# EAGLE design immerlighter-1.0 (EAGLE 5.12)
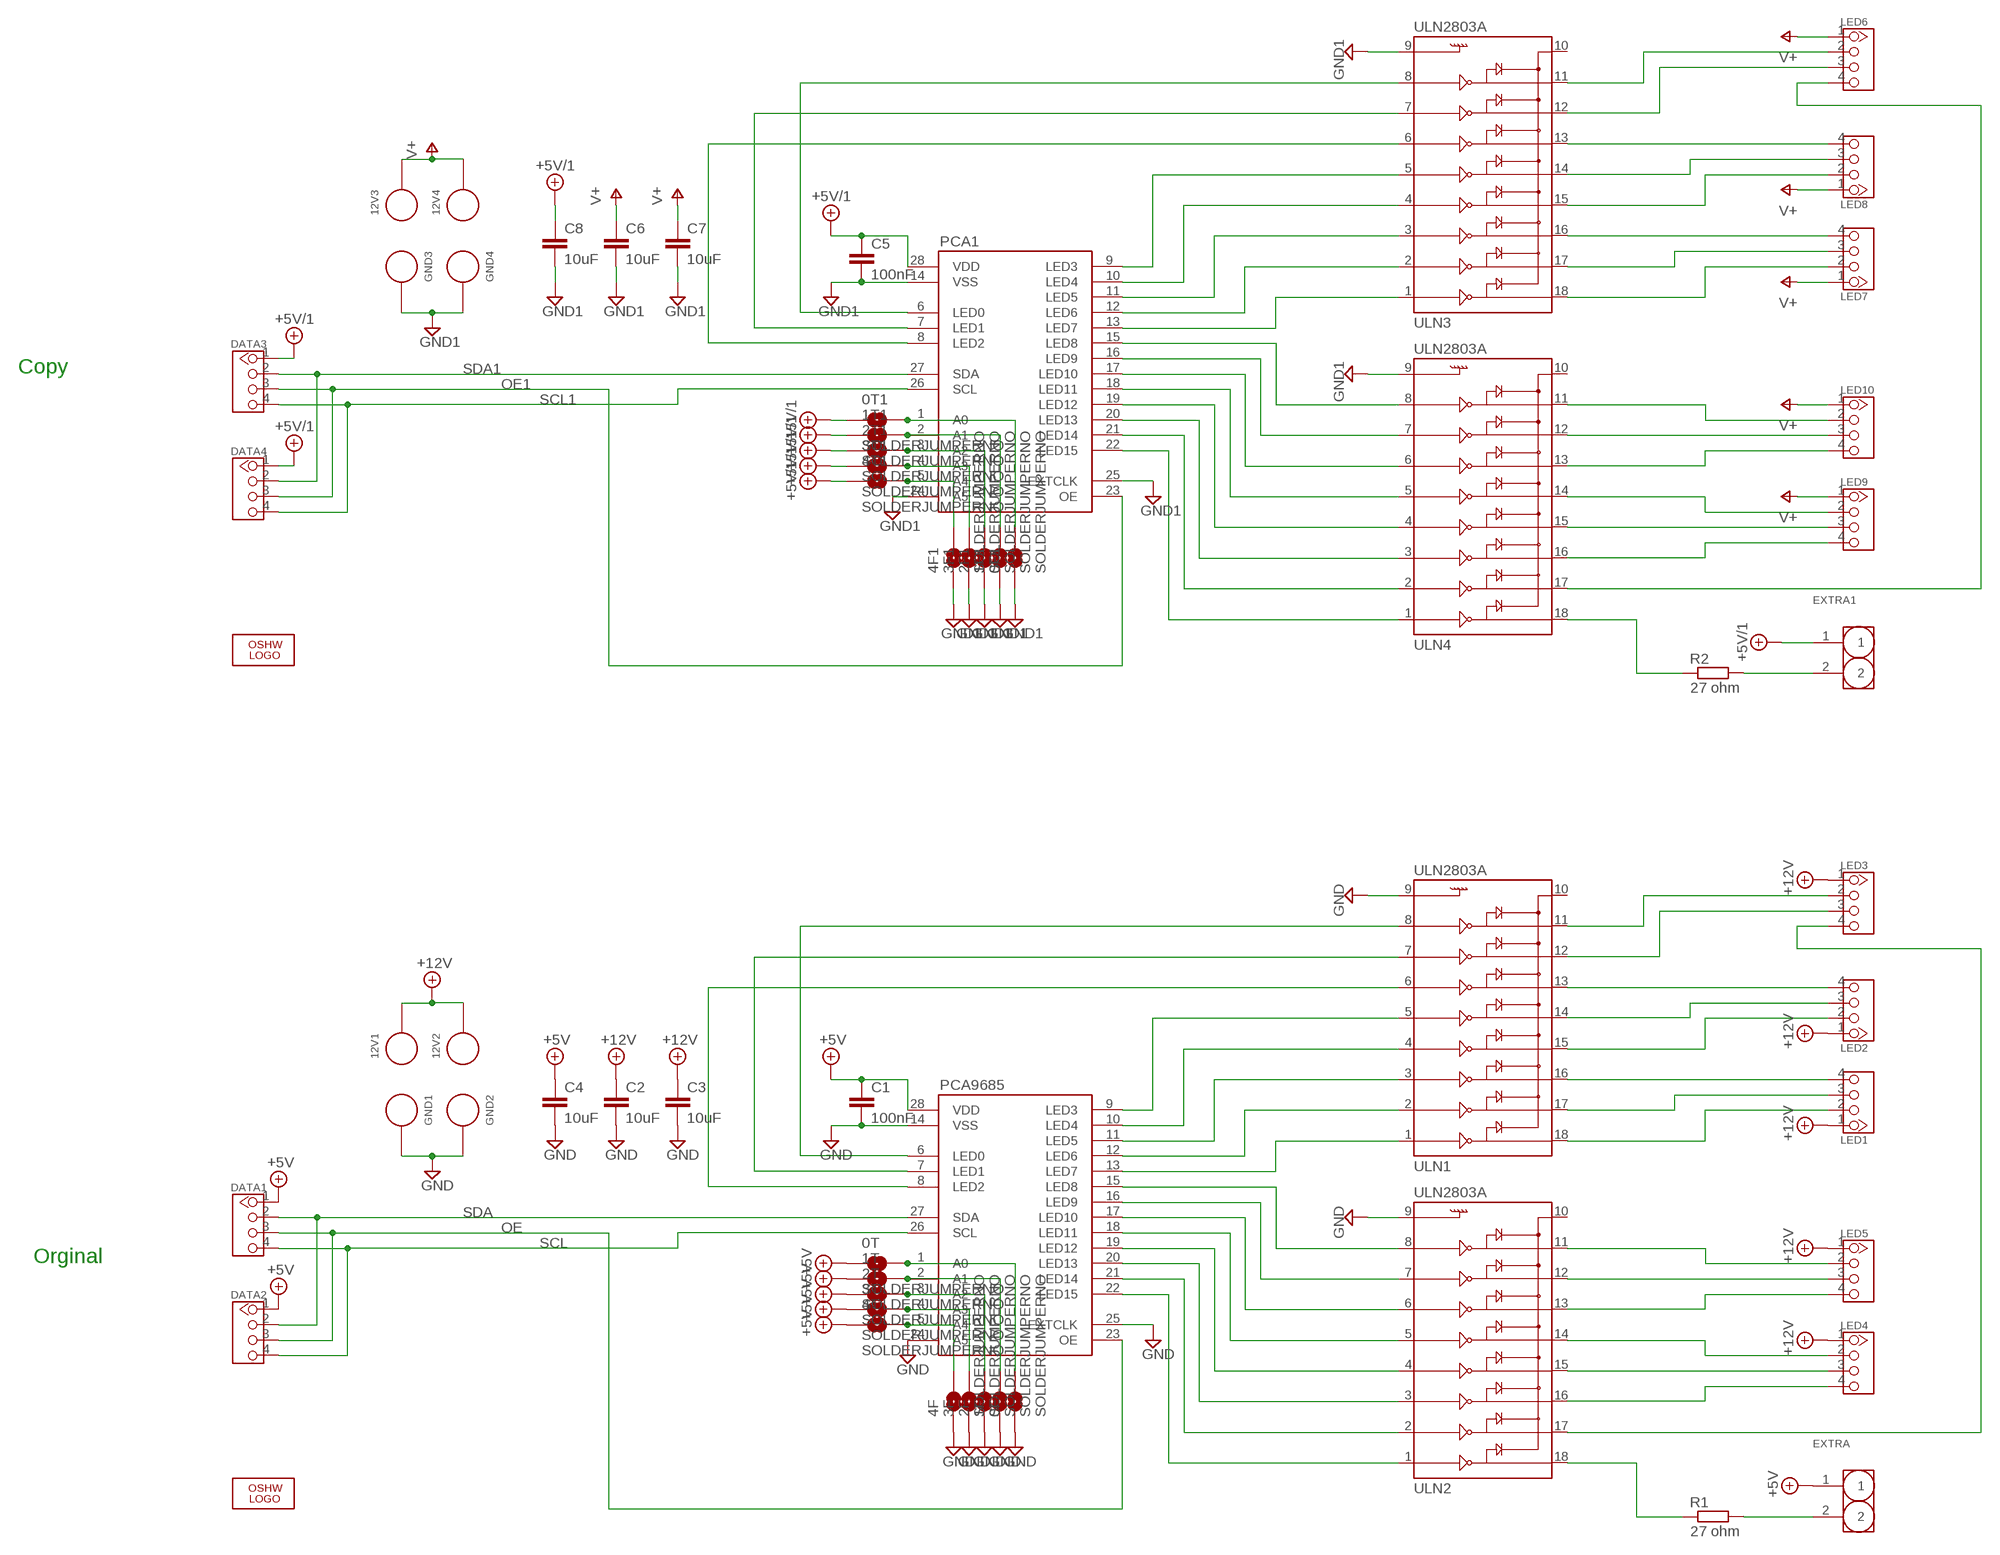
[diagram p0: schematic, sheet 1]

## Parts
0F  SOLDERJUMPERNO  [SJ_2S-NO]
0F1  SOLDERJUMPERNO  [SJ_2S-NO]
0T  SOLDERJUMPERNO  [SJ_2S-NO]
0T1  SOLDERJUMPERNO  [SJ_2S-NO]
1F  SOLDERJUMPERNO  [SJ_2S-NO]
1F1  SOLDERJUMPERNO  [SJ_2S-NO]
1T  SOLDERJUMPERNO  [SJ_2S-NO]
1T1  SOLDERJUMPERNO  [SJ_2S-NO]
2F  SOLDERJUMPERNO  [SJ_2S-NO]
2F1  SOLDERJUMPERNO  [SJ_2S-NO]
2T  SOLDERJUMPERNO  [SJ_2S-NO]
2T1  SOLDERJUMPERNO  [SJ_2S-NO]
3F  SOLDERJUMPERNO  [SJ_2S-NO]
3F1  SOLDERJUMPERNO  [SJ_2S-NO]
3T  SOLDERJUMPERNO  [SJ_2S-NO]
3T1  SOLDERJUMPERNO  [SJ_2S-NO]
4F  SOLDERJUMPERNO  [SJ_2S-NO]
4F1  SOLDERJUMPERNO  [SJ_2S-NO]
4T  SOLDERJUMPERNO  [SJ_2S-NO]
4T1  SOLDERJUMPERNO  [SJ_2S-NO]
12V1  LARGE_WIRE_PAD  [LARGE_WIRE_PAD_PACK]
12V2  LARGE_WIRE_PAD  [LARGE_WIRE_PAD_PACK]
12V3  LARGE_WIRE_PAD  [LARGE_WIRE_PAD_PACK]
12V4  LARGE_WIRE_PAD  [LARGE_WIRE_PAD_PACK]
C1  100nF  C-EUC3216  [C3216]
C2  10uF  C-EUC3216  [C3216]
C3  10uF  C-EUC3216  [C3216]
C4  10uF  C-EUC3216  [C3216]
C5  100nF  C-EUC3216  [C3216]
C6  10uF  C-EUC3216  [C3216]
C7  10uF  C-EUC3216  [C3216]
C8  10uF  C-EUC3216  [C3216]
DATA1  HEADER-4P-80/40MIL  [4P-2.54-80/40MIL]
DATA2  HEADER-4P-80/40MIL  [4P-2.54-80/40MIL]
DATA3  HEADER-4P-80/40MIL  [4P-2.54-80/40MIL]
DATA4  HEADER-4P-80/40MIL  [4P-2.54-80/40MIL]
EXTRA  HEADER-2P-2.54  [2P-2.54]
EXTRA1  HEADER-2P-2.54  [2P-2.54]
GND1  LARGE_WIRE_PAD  [LARGE_WIRE_PAD_PACK]
GND2  LARGE_WIRE_PAD  [LARGE_WIRE_PAD_PACK]
GND3  LARGE_WIRE_PAD  [LARGE_WIRE_PAD_PACK]
GND4  LARGE_WIRE_PAD  [LARGE_WIRE_PAD_PACK]
LED1  HEADER-4P-80/40MIL  [4P-2.54-80/40MIL]
LED2  HEADER-4P-80/40MIL  [4P-2.54-80/40MIL]
LED3  HEADER-4P-80/40MIL  [4P-2.54-80/40MIL]
LED4  HEADER-4P-80/40MIL  [4P-2.54-80/40MIL]
LED5  HEADER-4P-80/40MIL  [4P-2.54-80/40MIL]
LED6  HEADER-4P-80/40MIL  [4P-2.54-80/40MIL]
LED7  HEADER-4P-80/40MIL  [4P-2.54-80/40MIL]
LED8  HEADER-4P-80/40MIL  [4P-2.54-80/40MIL]
LED9  HEADER-4P-80/40MIL  [4P-2.54-80/40MIL]
LED10  HEADER-4P-80/40MIL  [4P-2.54-80/40MIL]
LOGO1  LOGO-OSHW-6MILX0070-NT  [OSHW_6X70_NOTEXT]
LOGO2  LOGO-OSHW-6MILX0070-NT  [OSHW_6X70_NOTEXT]
PCA1  PCA9685  [TSSOP28]
PCA9685  PCA9685  [TSSOP28]
R1  27 ohm  R-EU_R1206  [R1206]
R2  27 ohm  R-EU_R1206  [R1206]
ULN1  ULN2803A  ULN2803SOICW  [SO18L]
ULN2  ULN2803A  ULN2803SOICW  [SO18L]
ULN3  ULN2803A  ULN2803SOICW  [SO18L]
ULN4  ULN2803A  ULN2803SOICW  [SO18L]

## Nets
+5V: 0T.1 1T.1 2T.1 3T.1 4T.1 C1.1 C4.1 DATA1.1 DATA2.1 EXTRA.1 PCA9685.28(VDD)
+5V1: 0T1.1 1T1.1 2T1.1 3T1.1 4T1.1 C5.1 C8.1 DATA3.1 DATA4.1 EXTRA1.1 PCA1.28(VDD) ; supply symbol labelled +5V/1
+12V: 12V1.P$1 12V2.P$1 C2.1 C3.1 LED1.1 LED2.1 LED3.1 LED4.1 LED5.1
+12V1: 12V3.P$1 12V4.P$1 C6.1 C7.1 LED6.1 LED7.1 LED8.1 LED9.1 LED10.1 ; supply symbol labelled V+
GND: 0F.1 1F.1 2F.1 3F.1 4F.1 C1.2 C2.2 C3.2 C4.2 GND1.P$1 GND2.P$1 PCA9685.14(VSS) PCA9685.24(A5) PCA9685.25(EXTCLK) ULN1.9 ULN2.9
GND1: 0F1.1 1F1.1 2F1.1 3F1.1 4F1.1 C5.2 C6.2 C7.2 C8.2 GND3.P$1 GND4.P$1 PCA1.14(VSS) PCA1.24(A5) PCA1.25(EXTCLK) ULN3.9 ULN4.9
N$1: PCA9685.6(LED0) ULN1.8
N$2: PCA9685.7(LED1) ULN1.7
N$3: PCA9685.8(LED2) ULN1.6
N$4: PCA9685.9(LED3) ULN1.5
N$5: PCA9685.10(LED4) ULN1.4
N$6: PCA9685.11(LED5) ULN1.3
N$7: PCA9685.12(LED6) ULN1.2
N$8: PCA9685.13(LED7) ULN1.1
N$9: LED4.3 ULN2.15
N$10: LED5.3 ULN2.12
N$11: PCA1.6(LED0) ULN3.8
N$12: PCA9685.15(LED8) ULN2.8
N$13: PCA9685.16(LED9) ULN2.7
N$14: PCA9685.17(LED10) ULN2.6
N$15: PCA9685.18(LED11) ULN2.5
N$16: PCA9685.19(LED12) ULN2.4
N$17: PCA9685.20(LED13) ULN2.3
N$18: PCA9685.21(LED14) ULN2.2
N$19: PCA9685.22(LED15) ULN2.1
N$20: LED3.2 ULN1.11
N$21: LED2.2 ULN1.15
N$22: LED3.3 ULN1.12
N$23: LED2.4 ULN1.13
N$24: LED2.3 ULN1.14
N$25: 0F.2 0T.2 PCA9685.1(A0)
N$26: 1F.2 1T.2 PCA9685.2(A1)
N$27: 2F.2 2T.2 PCA9685.3(A2)
N$28: 3F.2 3T.2 PCA9685.4(A3)
N$29: 4F.2 4T.2 PCA9685.5(A4)
N$30: LED1.4 ULN1.16
N$31: LED3.4 ULN2.17
N$32: LED1.3 ULN1.17
N$33: EXTRA.2 R1.2
N$34: LED1.2 ULN1.18
N$35: R1.1 ULN2.18
N$36: LED4.4 ULN2.16
N$37: LED5.4 ULN2.13
N$38: LED4.2 ULN2.14
N$39: LED5.2 ULN2.11
N$40: PCA1.7(LED1) ULN3.7
N$41: PCA1.8(LED2) ULN3.6
N$42: PCA1.9(LED3) ULN3.5
N$43: PCA1.10(LED4) ULN3.4
N$44: PCA1.11(LED5) ULN3.3
N$45: PCA1.12(LED6) ULN3.2
N$46: PCA1.13(LED7) ULN3.1
N$47: PCA1.15(LED8) ULN4.8
N$48: PCA1.16(LED9) ULN4.7
N$49: PCA1.17(LED10) ULN4.6
N$50: PCA1.18(LED11) ULN4.5
N$51: PCA1.19(LED12) ULN4.4
N$52: PCA1.20(LED13) ULN4.3
N$53: PCA1.21(LED14) ULN4.2
N$54: PCA1.22(LED15) ULN4.1
N$55: 0F1.2 0T1.2 PCA1.1(A0)
N$56: 1F1.2 1T1.2 PCA1.2(A1)
N$57: 2F1.2 2T1.2 PCA1.3(A2)
N$58: 3F1.2 3T1.2 PCA1.4(A3)
N$59: 4F1.2 4T1.2 PCA1.5(A4)
N$60: LED6.3 ULN3.12
N$61: LED6.2 ULN3.11
N$62: LED8.3 ULN3.14
N$63: LED8.2 ULN3.15
N$64: LED7.3 ULN3.17
N$65: LED7.2 ULN3.18
N$66: LED6.4 ULN4.17
N$67: LED9.4 ULN4.16
N$68: LED9.2 ULN4.14
N$69: LED10.4 ULN4.13
N$70: LED10.2 ULN4.11
N$71: LED8.4 ULN3.13
N$72: LED7.4 ULN3.16
N$73: LED9.3 ULN4.15
N$74: LED10.3 ULN4.12
N$75: EXTRA1.2 R2.2
N$76: R2.1 ULN4.18
OE: DATA1.3 DATA2.3 PCA9685.23(OE)
OE1: DATA3.3 DATA4.3 PCA1.23(OE)
SCL: DATA1.4 DATA2.4 PCA9685.26(SCL)
SCL1: DATA3.4 DATA4.4 PCA1.26(SCL)
SDA: DATA1.2 DATA2.2 PCA9685.27(SDA)
SDA1: DATA3.2 DATA4.2 PCA1.27(SDA)
Unconnected: ULN1.10 ULN2.10 ULN3.10 ULN4.10

## Notes on the sheet
- Copy
- Orginal

## Library data of the parts
0F 0F1 0T 0T1 1F 1F1 1T 1T1 2F 2F1 2T 2T1 3F 3F1 3T 3T1 4F 4F1 4T 4T1 = SparkFun:SOLDERJUMPER: Solder Jumper Standard SMD solder jumper. Used to automate production. Two varients : Normally Open and Normally Closed are the same, but have different paste layers. NC will have a large amount of paste and should jumper during reflow.
12V1-12V4 GND1-GND4 = zzorn:LARGE_WIRE_PAD
C1-C8 = rcl:C-EU: CAPACITOR, European symbol
DATA1-DATA4 LED1-LED10 = Connector:HEADER-4P
EXTRA EXTRA1 = Connector:HEADER-2P
LOGO1 LOGO2 = Logo:LOGO-OSHW-6MIL
PCA1 PCA9685 = mylib:PCA9685
R1 R2 = rcl:R-EU_: RESISTOR, European symbol
ULN1-ULN4 = SparkFun:ULN2803: Darlington Driver ULN2803 Darlington array. 500mA max per channel, 8-channel package. Spark Fun Electronics SKU : COM-00312

## Board
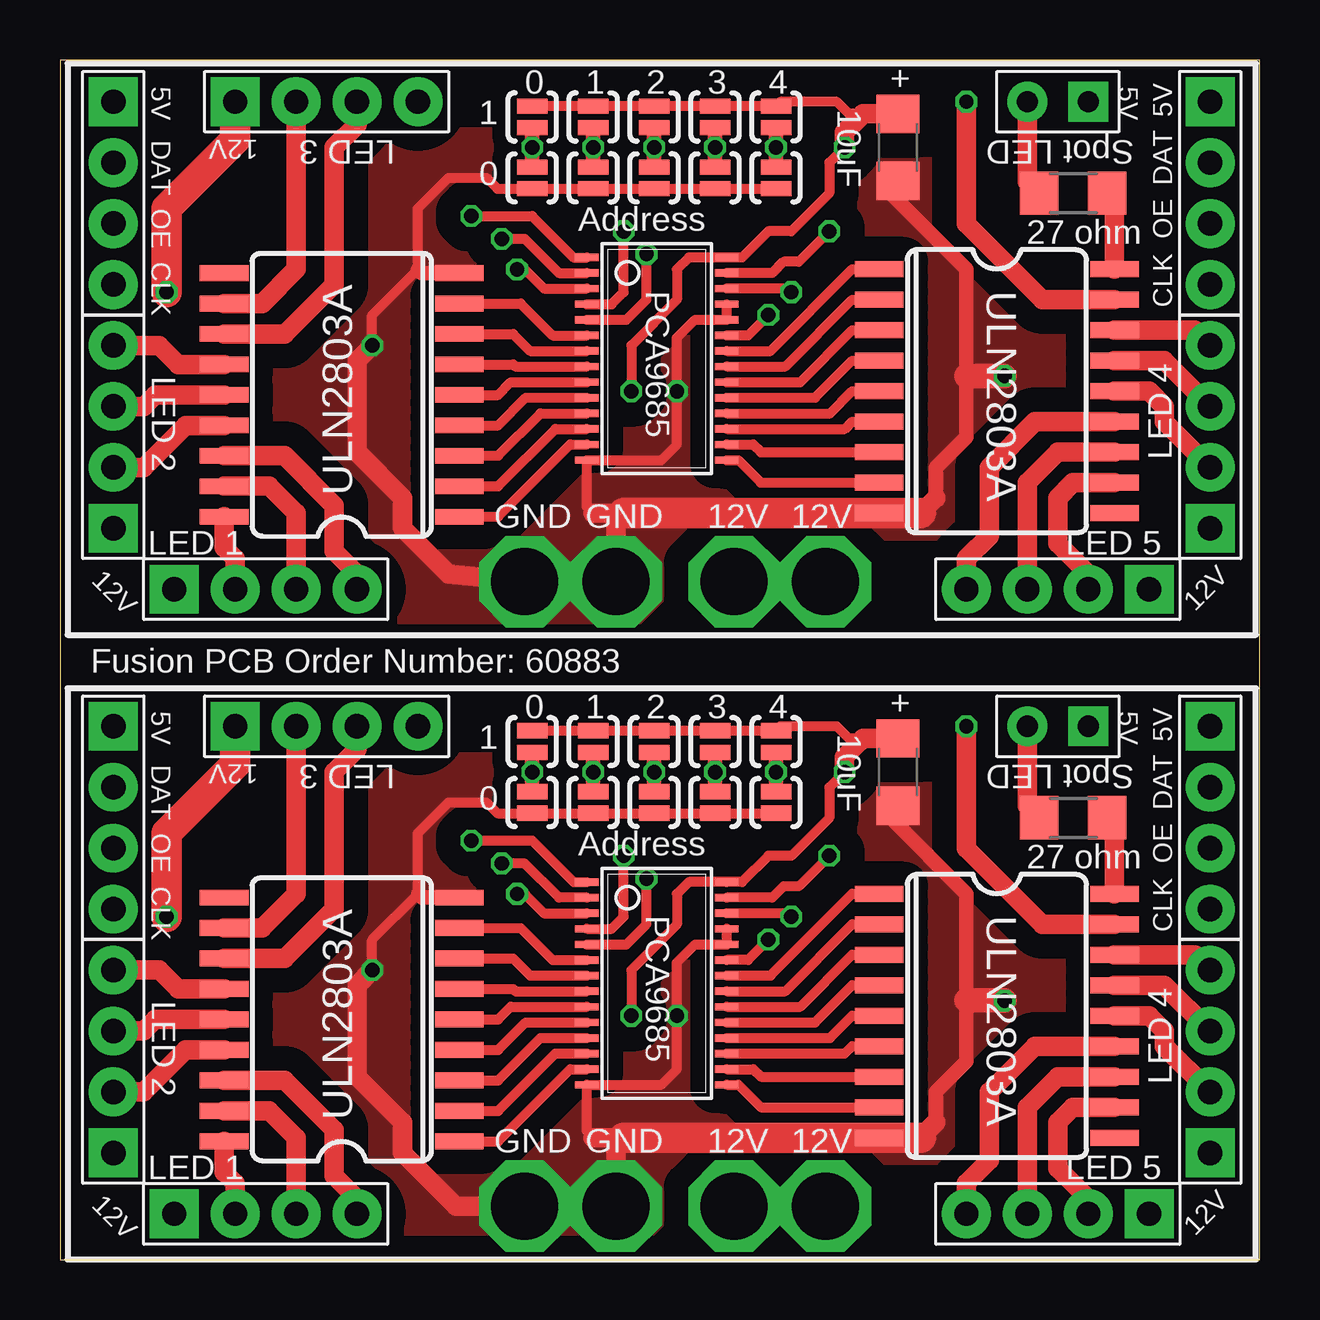
[diagram p1: board, top side]
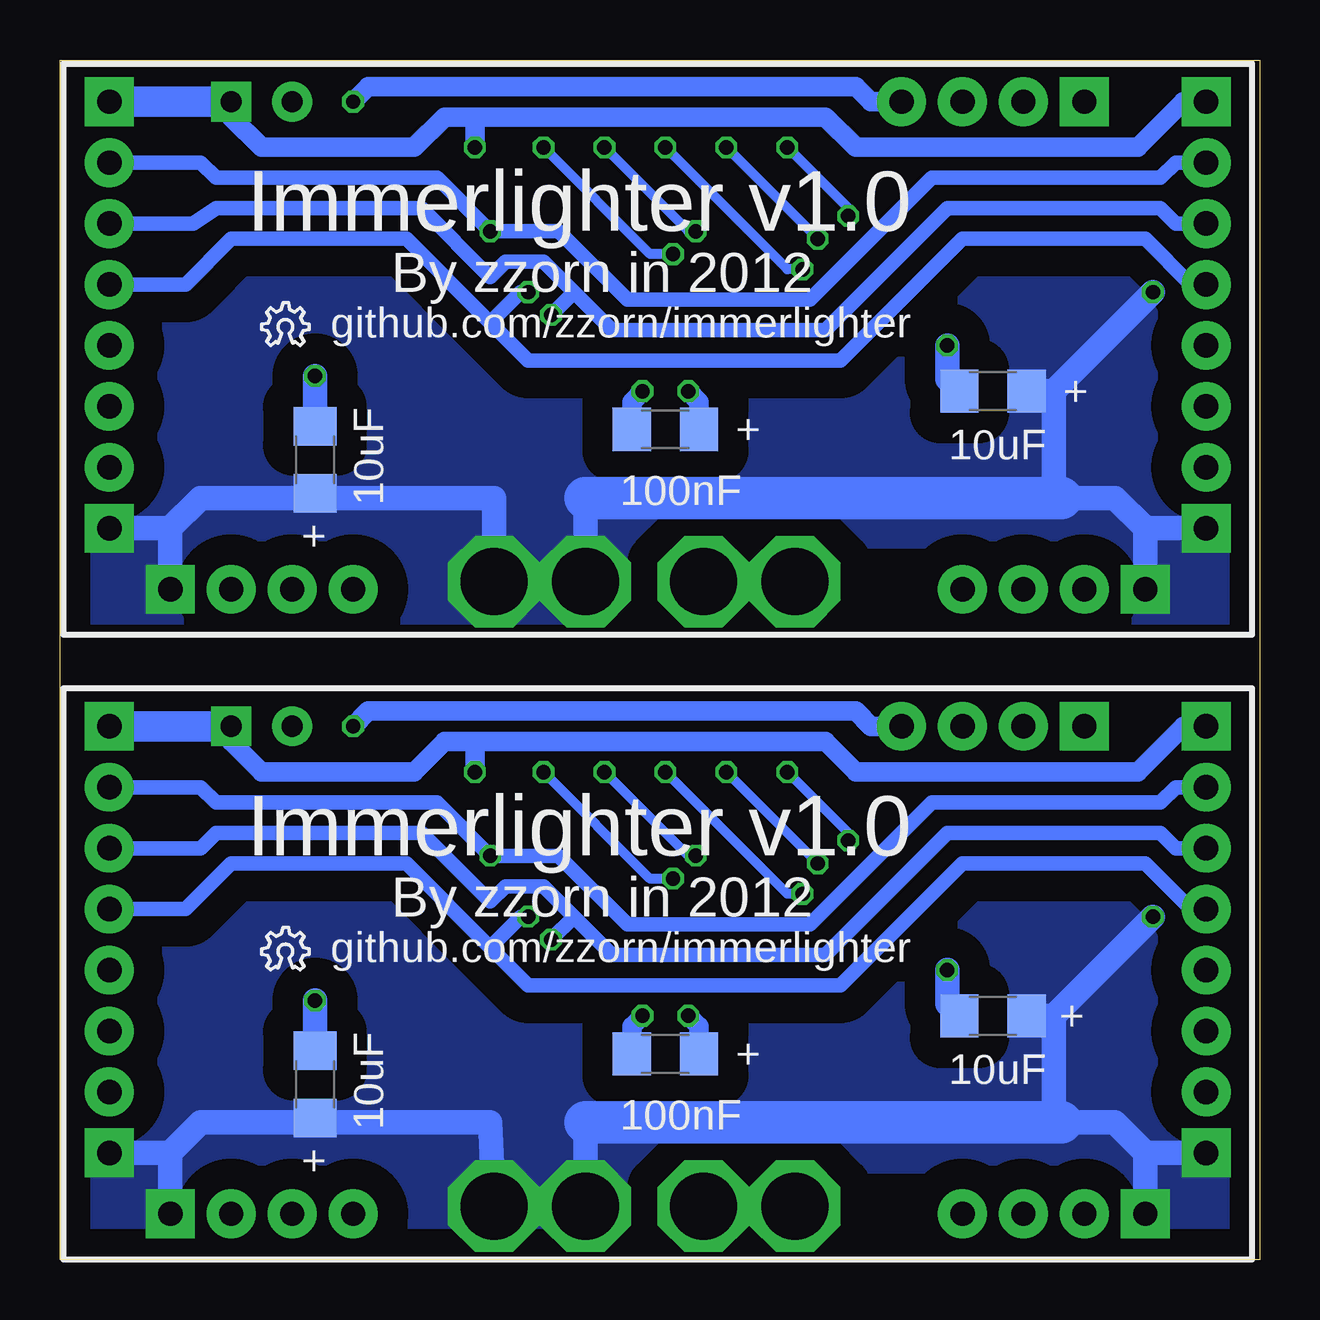
[diagram p2: board, bottom side, seen from below]

Size 50 x 50 mm. Coordinates in mm from the lower left corner, seen from the top.
Outline: 0,0 50,0 50,50 0,50 0,0
Copper layers (1*16): Top 0.035mm / dielectric 1.5mm / Bottom 0.035mm
Design rules "Fusion_eagle_rule_v1.1": minimum track width 6mil, minimum drill 12mil, track to track 6mil, track to pad 6mil, pad to pad 6mil, via to via 6mil, smd to smd 0mil, copper to edge 10mil, drill to drill 10mil, minimum pad ring 10mil, minimum via ring 6mil, stop-mask expansion 2mil, vias tented up to drill 100mil, thermal gap 10mil

### Footprints (pad centres in the part's own frame; a part is rotated, then mirrored left to right if it is on the bottom)
SJ_2S-NO = smd 0.635 x 1.27: 1 -0.45,0; 2 0.45,0
LARGE_WIRE_PAD_PACK = drill 2.8 pad 3.81 octagon: P$1 0,0
C3216 = smd 1.6 x 1.8: 1 -1.4,0; 2 1.4,0
4P-2.54-80/40MIL = drill 1.016 pad 2.032 square: 1 0,3.81 | drill 1.016 pad 2.032 round: 2 0,1.27; 3 0,-1.27; 4 0,-3.81
2P-2.54 = drill 0.889 pad 1.651 square: 1 0,1.27 | drill 0.889 pad 1.651 round: 2 0,-1.27
TSSOP28 = smd 0.305 x 0.991: 1 -4.225,-2.918; 2 -3.575,-2.918; 3 -2.925,-2.918; 4 -2.275,-2.918; 5 -1.625,-2.918; 6 -0.975,-2.918; 7 -0.325,-2.918; 8 0.325,-2.918; 9 0.975,-2.918; 10 1.625,-2.918; 11 2.275,-2.918; 12 2.925,-2.918; 13 3.575,-2.918; 14 4.225,-2.918; 15 4.225,2.918; 16 3.575,2.918; 17 2.925,2.918; 18 2.275,2.918; 19 1.625,2.918; 20 0.975,2.918; 21 0.325,2.918; 22 -0.325,2.918; 23 -0.975,2.918; 24 -1.625,2.918; 25 -2.275,2.918; 26 -2.925,2.918; 27 -3.575,2.918; 28 -4.225,2.918
R1206 = smd 1.6 x 1.803: 1 -1.422,0; 2 1.422,0
SO18L = smd 0.66 x 2.032: 1 -0.635,-4.902; 2 0.635,-4.902; 3 1.905,-4.902; 4 3.175,-4.902; 5 4.445,-4.902; 6 5.715,-4.902; 7 6.985,-4.902; 8 8.255,-4.902; 9 9.525,-4.902; 10 9.525,4.902; 11 8.255,4.902; 12 6.985,4.902; 13 5.715,4.902; 14 4.445,4.902; 15 3.175,4.902; 16 1.905,4.902; 17 0.635,4.902; 18 -0.635,4.902

### Placement (x,y rotation side)
0F  19.68,19.05 90 top
0F1  19.68,45.09 90 top
0T  19.68,21.59 270 top
0T1  19.68,47.62 270 top
1F  22.23,19.05 90 top
1F1  22.23,45.09 90 top
1T  22.23,21.59 270 top
1T1  22.23,47.62 270 top
2F  24.77,19.05 90 top
2F1  24.77,45.09 90 top
2T  24.77,21.59 270 top
2T1  24.77,47.62 270 top
3F  27.3,19.05 90 top
3F1  27.3,45.09 90 top
3T  27.3,21.59 270 top
3T1  27.3,47.62 270 top
4F  29.84,19.05 90 top
4F1  29.84,45.09 90 top
4T  29.84,21.59 270 top
4T1  29.84,47.62 270 top
12V1  31.91,2.22 0 top
12V2  28.1,2.22 0 top
12V3  31.91,28.26 0 top
12V4  28.1,28.26 0 top
C1  24.77,8.57 180 bottom
C2  39.37,7.3 90 bottom
C3  11.11,10.16 180 bottom
C4  34.92,20.32 270 top
C5  24.77,34.61 180 bottom
C6  39.37,33.34 90 bottom
C7  11.11,36.2 180 bottom
C8  34.92,46.35 270 top
DATA1  2.22,18.41 0 top
DATA2  47.94,18.41 0 top
DATA3  2.22,44.45 0 top
DATA4  47.94,44.45 0 top
EXTRA  41.59,22.23 270 top
EXTRA1  41.59,48.26 270 top
GND1  19.37,2.22 0 top
GND2  23.18,2.22 0 top
GND3  19.37,28.26 0 top
GND4  23.18,28.26 0 top
LED1  8.57,1.91 90 top
LED2  2.22,8.26 180 top
LED3  11.11,22.23 90 top
LED4  47.94,8.26 180 top
LED5  41.59,1.91 270 top
LED6  11.11,48.26 90 top
LED7  8.57,27.94 90 top
LED8  2.22,34.29 180 top
LED9  47.94,34.29 180 top
LED10  41.59,27.94 270 top
LOGO1  41.59,12.06 0 bottom
LOGO2  41.59,38.1 0 bottom
PCA1  24.88,37.55 270 top
PCA9685  24.88,11.51 270 top
R1  42.23,18.41 180 top
R2  42.23,44.45 180 top
ULN1  11.75,5.56 90 top
ULN2  39.05,14.61 270 top
ULN3  11.75,31.6 90 top
ULN4  39.05,40.64 270 top

### Tracks (layer width: path | path; a pad name or v marks a point on that pad's centre or on a via)
+5V  (via drill 0.6)
  Top 0.406: 0T.1 1T.1 2T.1 3T.1 4T.1 30.03,22.23 32.38,22.23 32.89,21.72 33.21,21.72 33.34,21.59 | v23.81,10.16 23.81,12.06 25.72,13.97 25.72,15.24 26.21,15.73 PCA9685.28 28.43,15.73 29.53,16.83 30.48,16.83 32.07,18.41 32.07,19.68 v32.7,20.32
  Top 0.813: C4.1 33.47,21.72 33.34,21.59 32.7,20.95 v32.7,20.32
  Bottom 0.813: 32.7,21.59 33.97,21.59 35.24,20.32 41.59,20.32 42.86,21.59 EXTRA.1 | 32.7,21.59 18.1,21.59 16.83,20.32 5.08,20.32 3.17,22.23 DATA1.1 | 32.7,21.59 v32.7,20.32 | C1.1 23.36,9.71 v23.81,10.16
  Bottom 1.27: EXTRA.1 DATA2.1
+5V1  (via drill 0.6)
  Top 0.406: 0T1.1 1T1.1 2T1.1 3T1.1 4T1.1 30.03,48.26 32.38,48.26 32.89,47.76 33.21,47.76 33.34,47.62 | v23.81,36.2 23.81,38.1 25.72,40.01 25.72,41.27 26.21,41.77 PCA1.28 28.43,41.77 29.53,42.86 30.48,42.86 32.07,44.45 32.07,45.72 v32.7,46.35
  Top 0.813: C8.1 33.47,47.76 33.34,47.62 32.7,46.99 v32.7,46.35
  Bottom 0.813: 32.7,47.62 33.97,47.62 35.24,46.35 41.59,46.35 42.86,47.62 EXTRA1.1 | 32.7,47.62 18.1,47.62 16.83,46.35 5.08,46.35 3.17,48.26 DATA3.1 | 32.7,47.62 v32.7,46.35 | C5.1 23.36,35.75 v23.81,36.2
  Bottom 1.27: EXTRA1.1 DATA4.1
+12V  (via drill 0.6)
  Top 1.27: LED3.1 7.3,20.64 4.45,17.78 v4.45,14.29
  Bottom 0.813: C3.1 9.84,10.29
  Bottom 1.016: 8.57,10.16 v4.45,14.29 | 8.57,10.16 C3.1 | 4.76,4.45 LED1.1 | 4.76,4.45 6.03,5.71 8.26,5.71 8.57,6.03 8.57,10.16 | 45.4,4.45 LED5.1 | 45.4,4.45 44.13,5.71 39.56,5.71 C2.1 39.18,5.71 32.07,5.71 12V1.P$1 12V2.P$1 28.1,5.71 | 45.4,4.45 LED4.1 | LED2.1 4.76,4.45
  Bottom 1.778: 8.26,5.71 28.1,5.71
  pour Bottom (isolate 1.27, no thermals): 0.32,21.27 49.53,21.27 49.21,0 17.46,0 17.46,3.81 12.7,3.81 12.7,0.32 0.32,0.32
+12V1  (via drill 0.6)
  Top 1.27: LED6.1 7.3,46.67 4.45,43.81 v4.45,40.32
  Bottom 0.813: C7.1 9.84,36.33
  Bottom 1.016: 8.57,36.2 v4.45,40.32 | 8.57,36.2 C7.1 | 4.76,30.48 LED7.1 | 4.76,30.48 6.03,31.75 8.26,31.75 8.57,32.07 8.57,36.2 | 45.4,30.48 LED10.1 | 45.4,30.48 44.13,31.75 39.56,31.75 C6.1 39.18,31.75 31.91,31.75 12V3.P$1 12V4.P$1 28.1,31.75 | 45.4,30.48 LED9.1 | LED8.1 4.76,30.48
  Bottom 1.778: 8.26,31.75 28.1,31.75
  pour Bottom (isolate 1.27, no thermals): 0.32,47.31 49.53,47.31 49.21,26.67 27.3,26.67 26.35,27.62 26.35,29.84 12.7,29.84 12.7,26.67 0.32,26.67
GND  (via drill 0.6)
  Top 0.406: 4F.1 3F.1 2F.1 1F.1 0F.1 18.23,18.6 17.78,19.05 16.19,19.05 14.92,17.78 14.92,15.24 13.02,13.34 v13.02,12.06 | 34.6,18.6 C4.2 | 22.23,5.08 21.96,5.34 PCA9685.14 25.07,7.29 25.72,7.94 v25.72,10.16 25.72,12.38 26.47,13.13 PCA9685.24 PCA9685.25
  Top 0.61: 34.6,18.6 34.6,18.42 37.78,15.24 37.78,10.79 37.78,8.26 36.51,6.99 36.51,5.71 | 35.88,5.08 ULN2.9 | ULN1.9 15.08,15.09 14.92,15.24
  Top 0.813: v13.02,12.06 12.38,11.43 12.38,7.62 14.29,5.71 14.29,4.45 16.51,2.22 GND1.P$1 GND2.P$1 23.18,5.08 | 23.18,5.08 22.23,5.08 | 23.18,5.08 23.5,5.08 | 35.88,5.08 36.51,5.71
  Top 1.016: 37.78,10.79 v39.37,10.79
  Top 1.27: 23.5,5.08 35.88,5.08
  Bottom 0.813: C1.2 26.16,9.71 v25.72,10.16
  Bottom 1.016: v13.02,12.06 13.02,10.66 C3.2 | v39.37,10.79 C2.2
  pour Top (isolate 1.016, no thermals): 0.32,20.95 49.53,20.95 49.21,0.32 37.78,0.32 37.78,4.13 26.04,4.13 25.4,3.49 25.4,1.91 23.5,0 0.32,0
GND1  (via drill 0.6)
  Top 0.406: 4F1.1 3F1.1 2F1.1 1F1.1 0F1.1 18.23,44.63 17.78,45.09 16.19,45.09 14.92,43.81 14.92,41.27 13.02,39.37 v13.02,38.1 | 34.6,44.63 C8.2 | 22.23,31.11 21.96,31.38 PCA1.14 25.07,33.32 25.72,33.97 v25.72,36.2 25.72,38.42 26.47,39.17 PCA1.24 PCA1.25
  Top 0.61: 34.6,44.63 34.6,44.45 37.78,41.27 37.78,36.83 37.78,34.29 36.51,33.02 36.51,31.75 | 35.88,31.11 ULN4.9 | ULN3.9 15.08,41.12 14.92,41.27
  Top 0.813: v13.02,38.1 12.38,37.47 12.38,33.66 14.29,31.75 14.29,30.48 16.19,28.57 GND3.P$1 GND4.P$1 23.18,31.11 | 23.18,31.11 22.23,31.11 | 23.18,31.11 23.5,31.11 | 35.88,31.11 36.51,31.75
  Top 1.016: 37.78,36.83 v39.37,36.83
  Top 1.27: 23.5,31.11 35.88,31.11
  Bottom 0.813: C5.2 26.16,35.75 v25.72,36.2
  Bottom 1.016: v13.02,38.1 13.02,36.7 C7.2 | v39.37,36.83 C6.2
  pour Top (isolate 1.016, no thermals): 0.32,46.99 49.53,46.99 49.21,26.35 37.78,26.35 37.78,30.16 25.72,30.16 25.08,29.53 25.08,27.62 24.13,26.67 0.32,26.67
N$1
  Top 0.406: PCA9685.6 20.54,12.48 19.2,13.82 ULN1.8
N$2
  Top 0.406: PCA9685.7 19.6,11.84 18.89,12.55 ULN1.7
N$3
  Top 0.406: PCA9685.8 18.98,11.19 18.89,11.28 ULN1.6
N$4
  Top 0.406: PCA9685.9 18.79,10.54 18.26,10.01 ULN1.5
N$5
  Top 0.406: PCA9685.10 19.41,9.88 18.26,8.74 ULN1.4
N$6
  Top 0.406: PCA9685.11 20.03,9.23 18.26,7.47 ULN1.3
N$7
  Top 0.406: PCA9685.12 20.65,8.59 18.26,6.2 ULN1.2
N$8
  Top 0.406: PCA9685.13 21.27,7.93 18.26,4.93 ULN1.1
N$9
  Top 0.813: ULN2.15 46.04,11.43 LED4.3
N$10
  Top 0.813: ULN2.12 41.59,7.62 40.32,6.35 LED5.3
N$11
  Top 0.406: PCA1.6 20.54,38.52 19.2,39.85 ULN3.8
N$12
  Top 0.406: PCA9685.15 28.27,7.29 29.21,6.35 ULN2.8
N$13
  Top 0.406: PCA9685.16 28.89,7.93 29.21,7.62 ULN2.7
N$14
  Top 0.406: PCA9685.17 32.72,8.59 33.02,8.89 ULN2.6
N$15
  Top 0.406: PCA9685.18 32.09,9.23 33.02,10.16 ULN2.5
N$16
  Top 0.406: PCA9685.19 31.48,9.88 33.02,11.43 ULN2.4
N$17
  Top 0.406: PCA9685.20 30.86,10.54 33.02,12.7 ULN2.3
N$18
  Top 0.406: PCA9685.21 30.23,11.19 33.02,13.97 ULN2.2
N$19
  Top 0.406: PCA9685.22 29.61,11.84 33.02,15.24 ULN2.1
N$20
  Top 0.813: ULN1.11 8.42,13.82 9.84,15.24 LED3.2
N$21
  Top 0.813: ULN1.15 5.24,8.74 3.49,6.99 LED2.2
N$22
  Top 0.813: ULN1.12 9.37,12.55 11.43,14.61 11.43,20.32 12.38,21.27 LED3.3
N$23
  Top 0.813: ULN1.13 4.92,11.28 4.13,12.06 LED2.4
N$24
  Top 0.813: ULN1.14 3.97,10.01 3.49,9.53 LED2.3
N$25  (via drill 0.6)
  Top 0.406: PCA9685.1 21.41,15.73 19.68,17.46 v17.14,17.46
  Top 0.61: 0T.2 v19.68,20.32 0F.2
  Bottom 0.406: v17.14,17.46 17.14,17.78 v19.68,20.32
N$26  (via drill 0.6)
  Top 0.406: PCA9685.2 20.79,15.09 19.37,16.51 v18.41,16.51
  Top 0.61: 1T.2 v22.23,20.32 1F.2
  Bottom 0.406: v18.41,16.51 v22.23,20.32
N$27  (via drill 0.6)
  Top 0.406: PCA9685.3 20.17,14.44 19.37,15.24 v19.05,15.24
  Top 0.61: 2T.2 v24.77,20.32 2F.2
  Bottom 0.406: v19.05,15.24 19.68,15.24 v24.77,20.32
N$28  (via drill 0.6)
  Top 0.406: PCA9685.4 22.99,13.79 23.5,14.29 v23.5,16.83
  Top 0.61: 3T.2 v27.3,20.32 3F.2
  Bottom 0.406: v23.5,16.83 23.81,16.83 v27.3,20.32
N$29  (via drill 0.6)
  Top 0.406: PCA9685.5 23.61,13.13 24.45,13.97 v24.45,15.88
  Top 0.61: 4T.2 v29.84,20.32 4F.2
  Bottom 0.406: v24.45,15.88 25.4,15.88 v29.84,20.32
N$30
  Top 0.813: ULN1.16 9.36,7.47 11.43,5.4 11.43,3.49 12.38,2.54 LED1.4
N$31  (via drill 0.6)
  Top 0.813: ULN2.17 40.96,13.97 37.78,17.14 v37.78,22.23
  Bottom 0.813: v37.78,22.23 37.15,22.86 16.83,22.86 16.19,22.23 LED3.4
N$32
  Top 0.813: ULN1.17 8.73,6.2 9.84,5.08 LED1.3
N$33
  Top 0.813: EXTRA.2 40.32,18.9 R1.2
N$34
  Top 0.813: ULN1.18 6.84,3.63 7.3,3.17 LED1.2
N$35
  Top 0.813: ULN2.18 43.95,18.11 R1.1
N$36
  Top 0.813: ULN2.16 47.31,12.7 LED4.4
N$37
  Top 0.813: ULN2.13 40.64,8.89 38.73,6.99 38.73,4.13 37.78,3.17 LED5.4
N$38
  Top 0.813: ULN2.14 45.4,10.16 46.04,9.53 46.04,8.89 LED4.2
N$39
  Top 0.813: ULN2.11 42.23,6.35 41.59,5.71 41.59,3.81 42.86,2.54 LED5.2
N$40
  Top 0.406: PCA1.7 19.6,37.87 18.89,38.58 ULN3.7
N$41
  Top 0.406: PCA1.8 18.98,37.22 18.89,37.31 ULN3.6
N$42
  Top 0.406: PCA1.9 18.79,36.57 18.26,36.04 ULN3.5
N$43
  Top 0.406: PCA1.10 19.41,35.92 18.26,34.77 ULN3.4
N$44
  Top 0.406: PCA1.11 20.03,35.27 18.26,33.5 ULN3.3
N$45
  Top 0.406: PCA1.12 20.65,34.62 18.26,32.23 ULN3.2
N$46
  Top 0.406: PCA1.13 21.27,33.97 18.26,30.96 ULN3.1
N$47
  Top 0.406: PCA1.15 28.27,33.32 29.21,32.38 ULN4.8
N$48
  Top 0.406: PCA1.16 28.89,33.97 29.21,33.66 ULN4.7
N$49
  Top 0.406: PCA1.17 32.72,34.62 33.02,34.92 ULN4.6
N$50
  Top 0.406: PCA1.18 32.09,35.27 33.02,36.2 ULN4.5
N$51
  Top 0.406: PCA1.19 31.48,35.92 33.02,37.47 ULN4.4
N$52
  Top 0.406: PCA1.20 30.86,36.57 33.02,38.73 ULN4.3
N$53
  Top 0.406: PCA1.21 30.23,37.22 33.02,40.01 ULN4.2
N$54
  Top 0.406: PCA1.22 29.61,37.87 33.02,41.27 ULN4.1
N$55  (via drill 0.6)
  Top 0.406: PCA1.1 21.41,41.77 19.68,43.5 v17.14,43.5
  Top 0.61: 0T1.2 v19.68,46.35 0F1.2
  Bottom 0.406: v17.14,43.5 17.14,43.81 v19.68,46.35
N$56  (via drill 0.6)
  Top 0.406: PCA1.2 20.79,41.12 19.37,42.55 v18.41,42.55
  Top 0.61: 1T1.2 v22.23,46.35 1F1.2
  Bottom 0.406: v18.41,42.55 v22.23,46.35
N$57  (via drill 0.6)
  Top 0.406: PCA1.3 20.17,40.47 19.37,41.27 v19.05,41.27
  Top 0.61: 2T1.2 v24.77,46.35 2F1.2
  Bottom 0.406: v19.05,41.27 19.68,41.27 v24.77,46.35
N$58  (via drill 0.6)
  Top 0.406: PCA1.4 22.99,39.82 23.5,40.32 v23.5,42.86
  Top 0.61: 3T1.2 v27.3,46.35 3F1.2
  Bottom 0.406: v23.5,42.86 23.81,42.86 v27.3,46.35
N$59  (via drill 0.6)
  Top 0.406: PCA1.5 23.61,39.17 24.45,40.01 v24.45,41.91
  Top 0.61: 4T1.2 v29.84,46.35 4F1.2
  Bottom 0.406: v24.45,41.91 25.4,41.91 v29.84,46.35
N$60
  Top 0.813: ULN3.12 9.37,38.58 11.43,40.64 11.43,46.35 12.38,47.31 LED6.3
N$61
  Top 0.813: ULN3.11 8.42,39.85 9.84,41.27 LED6.2
N$62
  Top 0.813: ULN3.14 3.97,36.04 3.49,35.56 LED8.3
N$63
  Top 0.813: ULN3.15 5.24,34.77 3.49,33.02 LED8.2
N$64
  Top 0.813: ULN3.17 8.73,32.23 9.84,31.11 LED7.3
N$65
  Top 0.813: ULN3.18 6.84,29.67 7.3,29.21 LED7.2
N$66  (via drill 0.6)
  Top 0.813: ULN4.17 40.96,40.01 37.78,43.18 v37.78,48.26
  Bottom 0.813: v37.78,48.26 37.15,48.9 16.83,48.9 16.19,48.26 LED6.4
N$67
  Top 0.813: ULN4.16 47.31,38.73 LED9.4
N$68
  Top 0.813: ULN4.14 45.4,36.2 46.04,35.56 46.04,34.92 LED9.2
N$69
  Top 0.813: ULN4.13 40.64,34.92 38.73,33.02 38.73,30.16 37.78,29.21 LED10.4
N$70
  Top 0.813: ULN4.11 42.23,32.38 41.59,31.75 41.59,29.84 42.86,28.57 LED10.2
N$71
  Top 0.813: ULN3.13 4.92,37.31 4.13,38.1 LED8.4
N$72
  Top 0.813: ULN3.16 9.36,33.5 11.43,31.43 11.43,29.53 12.38,28.57 LED7.4
N$73
  Top 0.813: ULN4.15 46.04,37.47 LED9.3
N$74
  Top 0.813: ULN4.12 41.59,33.66 40.32,32.38 LED10.3
N$75
  Top 0.813: EXTRA1.2 40.32,44.93 R2.2
N$76
  Top 0.813: ULN4.18 43.95,44.15 R2.1
OE  (via drill 0.6)
  Top 0.406: PCA9685.23 28.68,12.48 v29.53,13.34
  Bottom 0.61: DATA1.3 3.49,17.14 4.13,17.78 13.02,17.78 18.1,12.7 26.99,12.7 28.57,14.29 | 28.57,14.29 29.84,15.56 31.43,15.56 32.07,14.92 34.92,17.78 43.5,17.78 44.13,17.14 DATA2.3 | 28.57,14.29 v29.53,13.34
OE1  (via drill 0.6)
  Top 0.406: PCA1.23 28.68,38.52 v29.53,39.37
  Bottom 0.61: DATA3.3 3.49,43.18 4.13,43.81 13.02,43.81 18.1,38.73 26.99,38.73 28.57,40.32 | 28.57,40.32 29.84,41.59 31.43,41.59 32.07,40.96 34.92,43.81 43.5,43.81 44.45,43.18 DATA4.3 | 28.57,40.32 v29.53,39.37
SCL  (via drill 0.6)
  Top 0.406: PCA9685.26 30.33,14.44 v30.48,14.29
  Bottom 0.61: DATA1.4 2.86,14.61 4.76,16.51 12.38,16.51 17.46,11.43 30.48,11.43 32.07,13.02 | DATA2.4 44.77,14.61 42.86,16.51 35.56,16.51 32.07,13.02 | v30.48,14.29 30.8,14.29 32.07,13.02
SCL1  (via drill 0.6)
  Top 0.406: PCA1.26 30.33,40.47 v30.48,40.32
  Bottom 0.61: DATA3.4 2.86,40.64 4.76,42.55 12.38,42.55 17.46,37.47 30.48,37.47 32.07,39.05 | DATA4.4 44.77,40.64 42.86,42.55 35.56,42.55 32.07,39.05 | v30.48,40.32 30.8,40.32 32.07,39.05
SDA  (via drill 0.6)
  Top 0.406: PCA9685.27 29.69,15.09 30.16,15.56 30.8,15.56 v32.07,16.83
  Bottom 0.61: DATA1.2 3.49,19.68 4.13,19.05 13.65,19.05 18.73,13.97 26.35,13.97 29.21,16.83 v32.07,16.83 34.29,19.05 43.5,19.05 44.13,19.68 DATA2.2
SDA1  (via drill 0.6)
  Top 0.406: PCA1.27 29.69,41.12 30.16,41.59 30.8,41.59 v32.07,42.86
  Bottom 0.61: DATA3.2 3.49,45.72 4.13,45.09 13.65,45.09 18.73,40.01 26.35,40.01 29.21,42.86 v32.07,42.86 34.29,45.09 43.5,45.09 44.13,45.72 DATA4.2

### Text on the board
tPlace: + | +
bPlace: + | + | + | + | + | +
tNames: 5V | 0 | 1 | 2 | 3 | 4 | 5V | 5V | DAT | 12V | LED 3 | 1 | Spot LED | 0 | DAT | OE | Address | OE | CLK | CLK | LED 2 | LED 4 | GND | GND | 12V | 12V | LED 1 | LED 5 | 12V | 12V | Fusion PCB Order Number: 60883 | 5V | 0 | 1 | 2 | 3 | 4 | 5V | 5V | DAT | 12V | LED 3 | 1 | Spot LED | 0 | DAT | OE | Address | OE | CLK | CLK | LED 2 | LED 4 | GND | GND | 12V | 12V | LED 1 | LED 5 | 12V | 12V
bNames: Immerlighter v1.0 | By zzorn in 2012 | github.com/zzorn/immerlighter | Immerlighter v1.0 | By zzorn in 2012 | github.com/zzorn/immerlighter